# Altium schematic sheet [03]-USB-UART.SchDoc
size A4; SheetNumber: 3; SheetTotal: 4
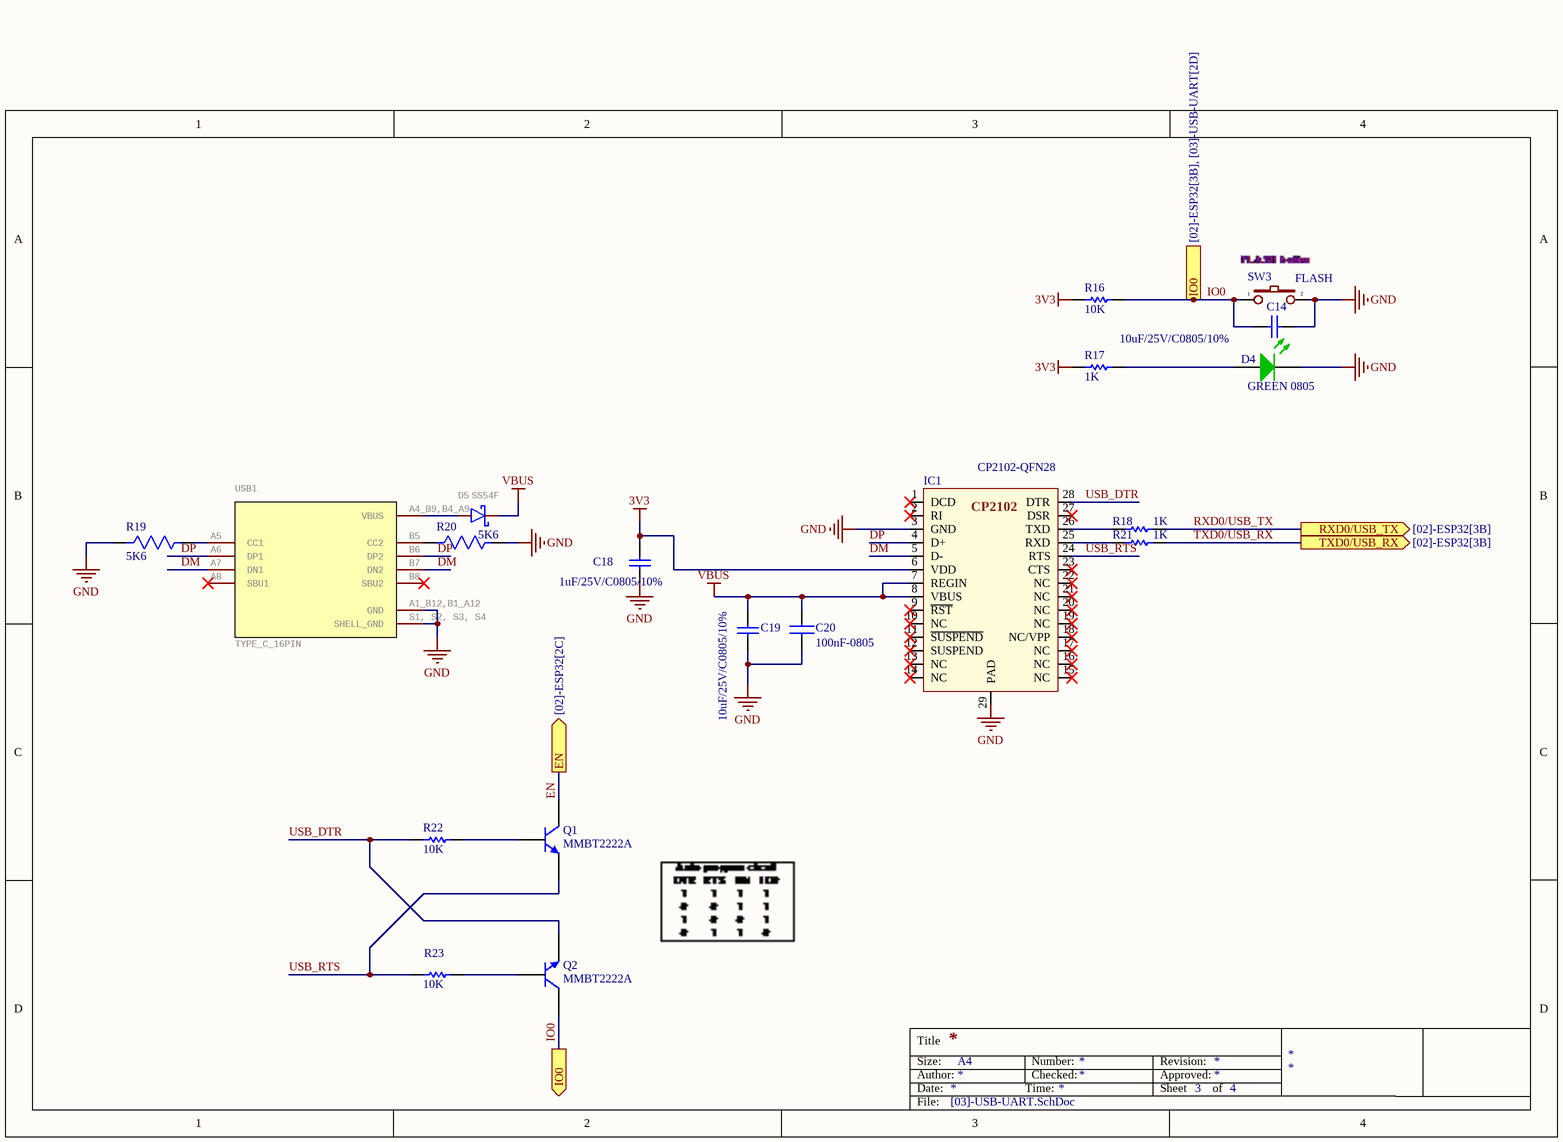
[diagram p0: [03]-USB-UART.SchDoc]

## Parts
C14  10uF/25V/C0805/10%  [CAP_CERA_C2012(CC0805INCH)]
C18  1uF/25V/C0805/10%  [CAP_CERA_C2012(CC0805INCH)]
C19  10uF/25V/C0805/10%  [CAP_CERA_C2012(CC0805INCH)]
C20  100nF-0805  [CAP0805]
D4  GREEN 0805  [Led 0805G]
D5  SS54F  [SMAF]
IC1  CP2102-QFN28  [CP2102-QFN28]
Q1  MMBT2222A  [SOT23-3]
Q2  MMBT2222A  [SOT23-3]
R16  10K  [Res 0805 SMD]
R17  1K  [Res 0805 SMD]
R18  1K  [Res 0603 SMD]
R19  5K6  [R0805]
R20  5K6  [R0805]
R21  1K  [Res 0603 SMD]
R22  10K  [Res 0805 SMD]
R23  10K  [Res 0805 SMD]
SW3  FLASH  [Button 3x4mm]
USB1  TYPE_C_16PIN  [USB_TYPEC_16PIN]

## Ports
EN (out, see [02]-ESP32[2C]), IO0 (out, see [02]-ESP32[3B], [03]-USB-UART[2D]), IO0 (out, see [02]-ESP32[3B], [03]-USB-UART[4A]), RXD0/USB_TX (out, see [02]-ESP32[3B]), TXD0/USB_RX (out, see [02]-ESP32[3B])

## Nets
3V3: C18.1 IC1.6(VDD) R16.1 R17.1
GND: C14.2 C18.2 C19.1 C20.2 D4.2(K) IC1.3(GND) IC1.29(PAD) R19.1 R20.2 SW3.2 USB1.A1_B12,B1_A12(GND) USB1.S1,_S2,_S3,_S4(SHELL_GND)
VBUS: C19.2 C20.1 D5.C IC1.7(REGIN) IC1.8(VBUS)
DM: IC1.5(D-) USB1.A7(DN1) USB1.B7(DN2)
DP: IC1.4(D+) USB1.A6(DP1) USB1.B6(DP2)
EN: Q1.3(C) ; port EN
IO0: C14.1 Q2.3(C) R16.2 SW3.1 ; port IO0
RXD0/USB_TX: R18.2 ; port RXD0/USB_TX
TXD0/USB_RX: R21.2 ; port TXD0/USB_RX
USB_DTR: IC1.28(DTR) Q2.2(E) R22.1
USB_RTS: IC1.24(RTS) Q1.2(E) R23.1
NetD4_1: D4.1(A) R17.2
NetD5_A: D5.A USB1.A4_B9,B4_A9(VBUS)
NetIC1_25: IC1.25(RXD) R21.1
NetIC1_26: IC1.26(TXD) R18.1
NetQ1_1: Q1.1(B) R22.2
NetQ2_1: Q2.1(B) R23.2
NetR19_2: R19.2 USB1.A5(CC1)
NetR20_1: R20.1 USB1.B5(CC2)

Not connected (* = marked no-connect by the designer): IC1 1(DCD)* 2(RI)* 9(~{RST})* 10(NC)* 11(~{SUSPEND})* 12(SUSPEND)* 13(NC)* 14(NC)* 15(NC)* 16(NC)* 17(NC)* 18(NC/VPP)* 19(NC)* 20(NC)* 21(NC)* 22(NC)* 23(CTS)* 27(DSR)*; USB1 A8(SBU1)* B8(SBU2)*

## Notes on the sheet
- Title
- Size:
- Date:
- Author:
- A4
- Time:
- Number:
- Checked:
- Revision:
- Sheet
- Approved:
- of
- File:

## Library data of the parts
C14 C18 C19 = 0.1uF/50V/C0603/10%_6: 0.1µF ±10% 25V Ceramic Capacitor X7R 0805 (2012 Metric); ComponentLink1URL: http://www.murata.com/~/media/webrenewal/support/library/catalog/products/capacitor/mlcc/c02e.ashx; ComponentLink1Description: http://www.murata.com/~/media/webrenewal/support/library/catalog/products/capacitor/mlcc/c02e.ashx; Digikey: 478-3755-1-ND
C20 = CC0805KRX7R9BB104: CAP CER 0.1UF 50V X7R 0805; Manufacturer: Yageo; Tolerance: ±10%; Notification: Current market demand for these product types have resulted in fluctuating and extending lead times. Lead times may differ.; Supplier 1: Digi-Key; Manufacturer Part Number: CC0805KRX7R9BB104; RoHS: RoHS Compliant; Category: Capacitors; Stock 1: 0; Pricing 1: 1=0.13, 10=0.093, 100=0.0439, 500=0.03076, 1000=0.02547 (USD); Packaging: Cut Tape (CT); Part Status: Active; Voltage - Rated: 50V; Temperature Coefficient: X7R; Operating Temperature: -55°C ~ 125°C; Features: High Voltage; Ratings: -; Applications: General Purpose; Failure Rate: -; Mounting Type: Surface Mount, MLCC; Package / Case: 0805 (2012 Metric); Size / Dimension: 0.079" L x 0.049" W (2.00mm x 1.25mm); Height - Seated (Max): -; Thickness (Max): 0.033" (0.85mm); Lead Spacing: -; Lead Style: -; ComponentLink1URL: http://www.yageo.com/documents/recent/UPY-GPHC_X7R_6.3V-to-50V_18.pdf; ComponentLink1Description: http://www.yageo.com/documents/recent/UPY-GPHC_X7R_6.3V-to-50V_18.pdf; Supplier Part Number 1: 311-1140-1-ND
D4 = LED GREEN 0603: Green 571nm LED Indication - Discrete 2V 0805 (2012 Metric); ComponentLink1URL: http://optoelectronics.liteon.com/upload/download/DS22-2000-074/S_110_LTST-C190KGKT.pdf; ComponentLink1Description: http://optoelectronics.liteon.com/upload/download/DS22-2000-074/S_110_LTST-C190KGKT.pdf; Digikey: 160-1426-1-ND
D5 = SS54F: GateName_1: G$1; SymbolName_1: DIODE_S; LibraryName: Uy_SMD; DeviceSetName: SS54F; Package: SMAF
IC1 = CP2102: USB Bridge, USB to UART USB 2.0 UART Interface 28-QFN (5x5); Digikey: 336-3694-ND; VNBuy: https://banlinhkien.vn/goods-2607-cp2102-qfn28.html
Q1 Q2 = MMBT2222A: TRANS NPN 40V 1A SOT-23; Manufacturer: ON Semiconductor; Vce Saturation (Max) @ Ib, Ic: 1V @ 50mA, 500mA; Current - Collector Cutoff (Max): 10nA (ICBO); DC Current Gain (hFE) (Min) @ Ic, Vce: 100 @ 150mA, 10V; Frequency - Transition: 300MHz; Supplier 1: Digi-Key; Manufacturer Part Number: MMBT2222A; RoHS: RoHS Compliant; Category: Discrete Semiconductor Products; Stock 1: 220769; Pricing 1: 1=0.21, 10=0.17, 100=0.09, 500=0.05922, 1000=0.04027 (USD); Packaging: Cut Tape (CT); Part Status: Last Time Buy; Transistor Type: NPN; Operating Temperature: 150°C (TJ); Mounting Type: Surface Mount; Package / Case: TO-236-3, SC-59, SOT-23-3; Supplier Device Package: SOT-23-3; Base Part Number: MMBT2222; ComponentLink1URL: https://www.fairchildsemi.com/datasheets/MM/MMBT2222A.pdf; ComponentLink1Description: https://www.fairchildsemi.com/datasheets/MM/MMBT2222A.pdf; Supplier Part Number 1: MMBT2222AFSCT-ND
R16 R22 R23 = 34.8K/R0805/1%_2: 10 kOhms ±1% 0.125W, 1/8W Chip Resistor 0805 (2012 Metric) Thick Film; Power Rating: 100mW; Resistance: 34.8kR; Voltage Rating: 50V; Case/Package: 0603; Case Code (Imperial): 0603; Case Code (Metric): 1608; Min Operating Temperature: -55°C; Max Operating Temperature: 155°C; Termination: SMD/SMT; Military Standard: Not; Voltage Rating (DC): 50V; Length: 1.6mm; Height: 0.45mm; Width: 0.8mm; Depth: 0.8mm; Lead Free: Lead Free; Digikey: A126332CT-ND
R17 = 34.8K/R0805/1%: 1 kOhms ±1% 0.125W, 1/8W Chip Resistor 0805 (2012 Metric) Automotive AEC-Q200 Thick Film; Power Rating: 100mW; Resistance: 34.8kR; Voltage Rating: 50V; Case/Package: 0603; Case Code (Imperial): 0603; Case Code (Metric): 1608; Min Operating Temperature: -55°C; Max Operating Temperature: 155°C; Termination: SMD/SMT; Military Standard: Not; Voltage Rating (DC): 50V; Length: 1.6mm; Height: 0.45mm; Width: 0.8mm; Depth: 0.8mm; Lead Free: Lead Free; Digikey: 541-1.00KCCT-ND
R18 R21 = 15K/R0603/1%: RES SMD 1K OHM 1% 1/10W 0603; Manufacturer: Yageo; Manufacturer Part Number: RC0603FR-0715KL; Resistance (Ohms): 15k; Power (Watts): 0.1W, 1/10W; Temperature Coefficient: ±100ppm/°C; RoHS: RoHS Compliant; Category: Resistors; Packaging: Digi-Reel®; Tolerance: ±1%; Composition: Thick Film; Features: Moisture Resistant; Operating Temperature: -55°C ~ 155°C; Package / Case: 0603 (1608 Metric); Supplier Device Package: 0603; Size / Dimension: 0.063" L x 0.031" W (1.60mm x 0.80mm); Height: 0.022" (0.55mm); Number of Terminations: 2; ComponentLink1URL: http://www.yageo.com/NewPortal/yageodocoutput?fileName=/pdf/R-Chip/PYu-RC_Group_51_RoHS_L_3.pdf; ComponentLink1Description: http://www.yageo.com/NewPortal/yageodocoutput?fileName=/pdf/R-Chip/PYu-RC_Group_51_RoHS_L_3.pdf; Supplier 1: Digi-Key; Supplier Part Number 1: 311-15.0KHRCT-ND
R19 R20 = Resistor 0805: SMD Resistor 0805; Manufacturer: Yageo; Manufacturer Part Number: RC0603FR-071KL; Power Rating: 100mW; Tolerance: 1%; Temperature Coefficient: 100ppm/°C; Voltage Rating: 50V; Supplier: Digi-Key; Supplier Part Number: 311-1.00KHRDKR-ND; RoHS: Yes; Category: Chip SMD Resistors; Stock: 18662657; Pricing: 1=0.1, 10=0.018, 50=0.0106, 100=0.0088, 500=0.00592, 1000=0.00505 (USD); Case/Package: 0603; Case Code (Imperial): 0603; Case Code (Metric): 1608; Contact Plating: Tin,Matte; Min Operating Temperature: -55°C; Max Operating Temperature: 155°C; Packaging: Tape and Reel; Resistor Type: Thick Film; Termination: SMD/SMT; Features: Moisture Resistant; Series: RC; Max Power Dissipation: 100mW; Number of Terminations: 2; Resistance Tolerance: 1%; Construction: Rectangular; Technology: THICK FILM; Length: 1.6mm; Height: 0.45mm; Depth: 0.8mm; Reach SVHC Compliant: No; Military Standard: Not; Lead Free: 5697LeadFree; RoHS Compliant: Yes
SW3 = SW2: SWITCH TACTILE SPST-NO 0.05A 12V; Digikey: CKN10384CT-ND
USB1 = TYPE_C_16PIN: GateName_1: G$1; SymbolName_1: USB4105-GF-A; DeviceSetName: TYPE_C_FEMALE; MF: GCT; LibraryName: Uy_SMD; Package: GCT_USB4105-GF-A; AVAILABILITY: Warning; MP: USB4105-GF-A; PACKAGE: None; PRICE: None